# EAGLE design FT232 (EAGLE 8.1.0)
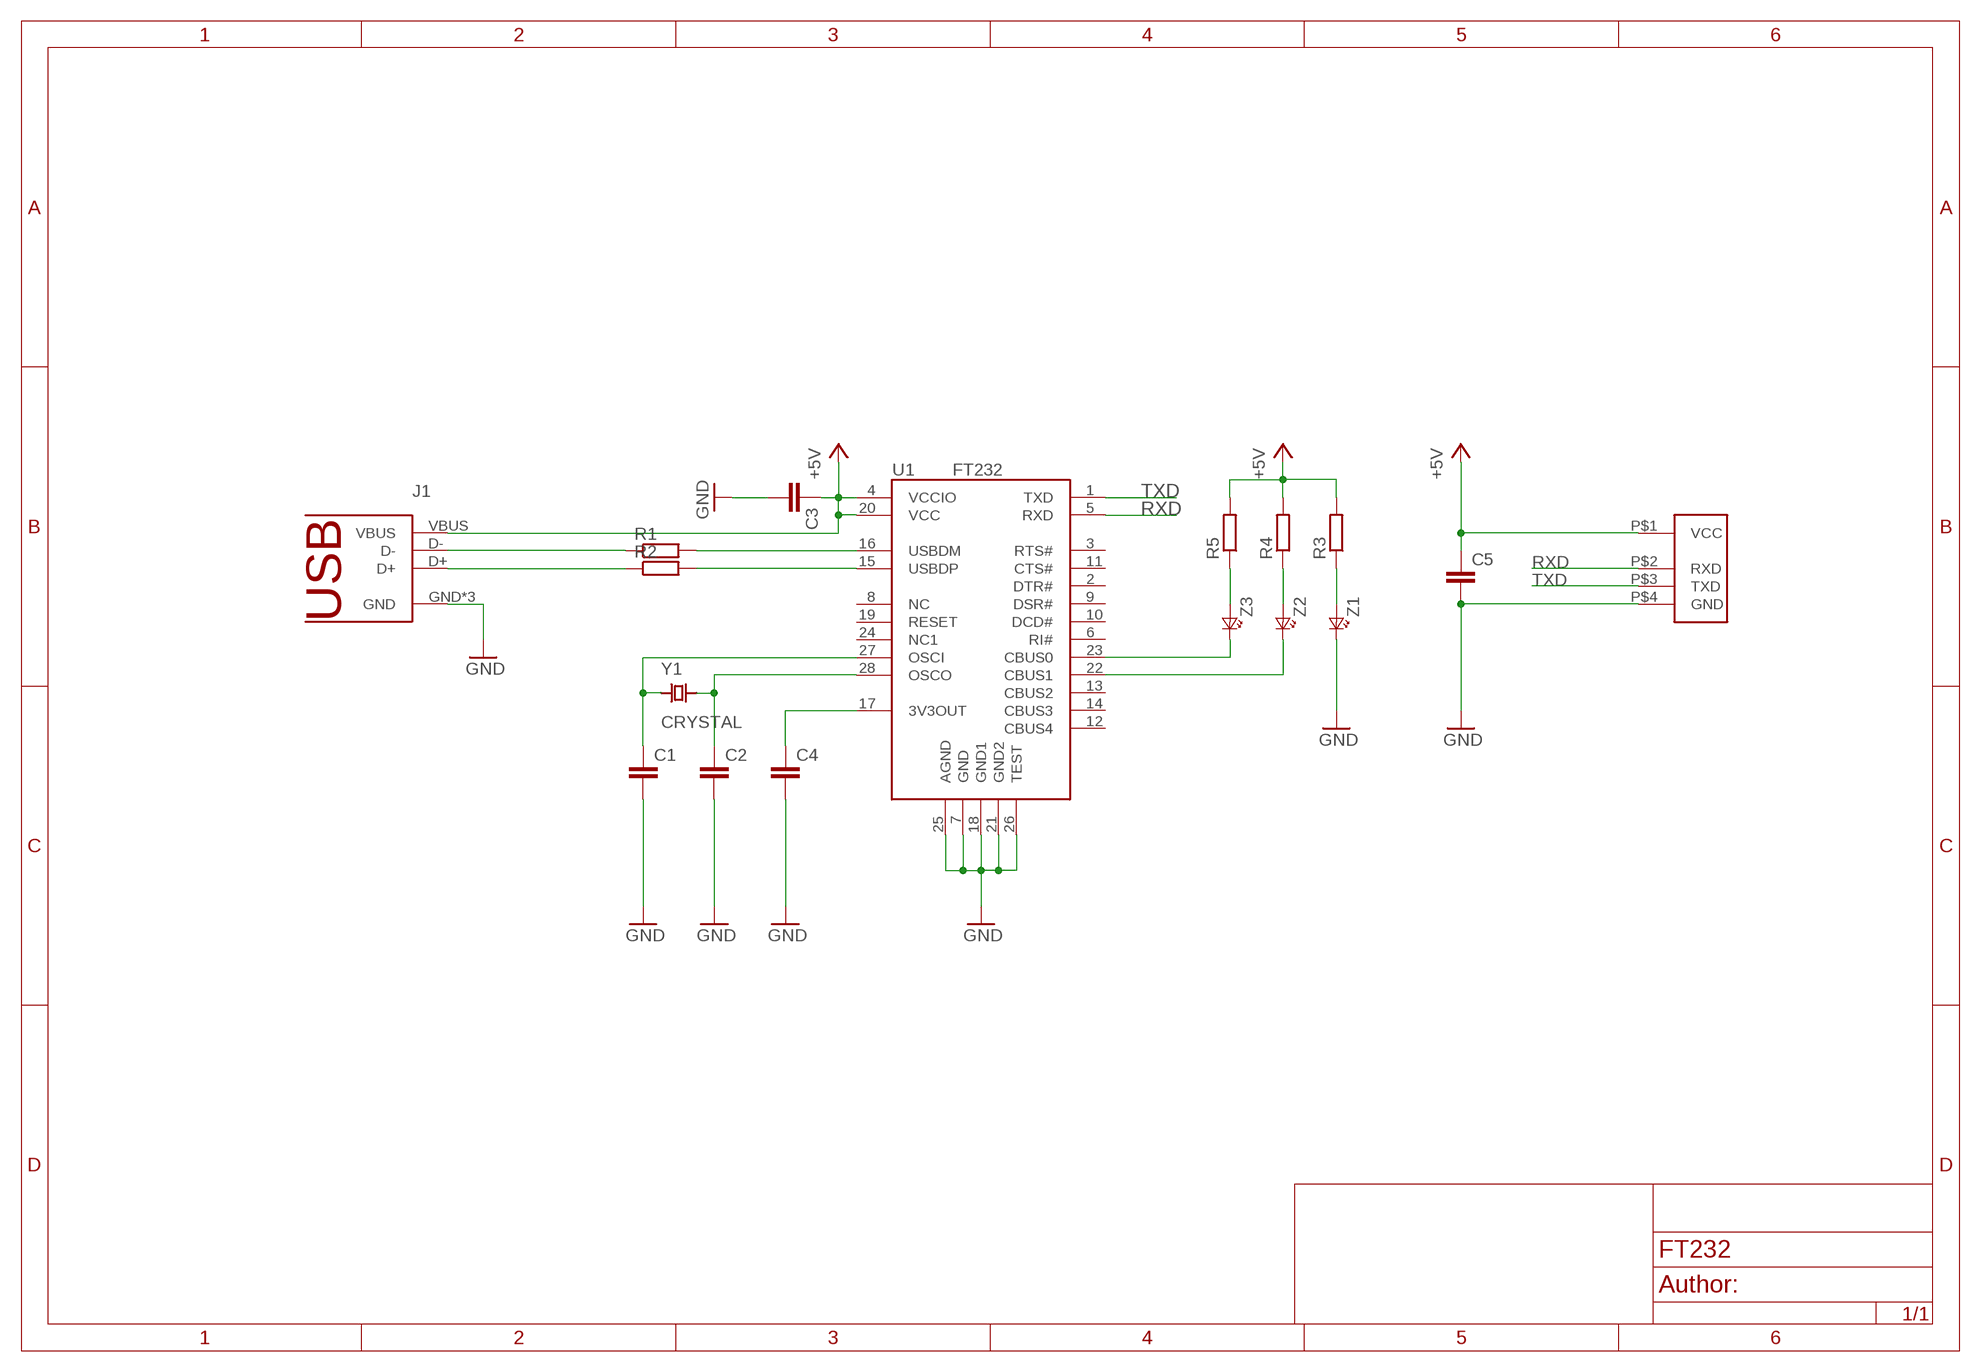
[diagram p0: schematic, sheet 1]

## Parts
C1  CAPACITOR0402  [C0402]
C2  CAPACITOR0402  [C0402]
C3  CAPACITOR0402  [C0402]
C4  CAPACITOR0402  [C0402]
C5  CAPACITOR0402  [C0402]
J1  USBA  [USB_A]
J2  CON  [CON4]
R1  RESISTOR0402  [R0402]
R2  RESISTOR0402  [R0402]
R3  RESISTOR0402  [R0402]
R4  RESISTOR0402  [R0402]
R5  RESISTOR0402  [R0402]
U1  FT232  [SSOP28]
Y1  CRYSTAL  [CRYSTAL5032]
Z1  LED  [LED0805]
Z2  LED  [LED0805]
Z3  LED  [LED0805]

## Nets
+5V: C3.1 C5.1 J1.VBUS J2.P$1(VCC) R3.2 R4.2 R5.2 U1.4(VCCIO) U1.20(VCC)
D_N: R1.2 U1.16(USBDM)
D_P: R2.2 U1.15(USBDP)
GND: C1.2 C2.2 C3.2 C4.2 C5.2 J1.GND J1.GND1(GND) J1.GND2(GND) J2.P$4(GND) U1.7(GND) U1.18(GND1) U1.21(GND2) U1.25(AGND) U1.26(TEST) Z1.K
N$3: J1.D- R1.1
N$4: J1.D+ R2.1
N$5: C2.1 U1.28(OSCO) Y1.2
N$6: C1.1 U1.27(OSCI) Y1.1
N$7: C4.1 U1.17(3V3OUT)
N$8: U1.23(CBUS0) Z3.K
N$9: U1.22(CBUS1) Z2.K
N$10: R5.1 Z3.A
N$11: R4.1 Z2.A
N$12: R3.1 Z1.A
RXD: J2.P$2(RXD) U1.5(RXD)
TXD: J2.P$3(TXD) U1.1(TXD)
Unconnected: U1.2(DTR#) U1.3(RTS#) U1.6(RI#) U1.8(NC) U1.9(DSR#) U1.10(DCD#) U1.11(CTS#) U1.12(CBUS4) U1.13(CBUS2) U1.14(CBUS3) U1.19(RESET) U1.24(NC1)

## Notes on the sheet
- Author:

## Library data of the parts
C1-C5 = FT232:CAPACITOR
J1 = FT232:USB
J2 = FT232:CON
R1-R5 = FT232:RESISTOR
U1 = FT232:FT232
Y1 = FT232:CRYSTAL
Z1-Z3 = FT232:LED

## Board
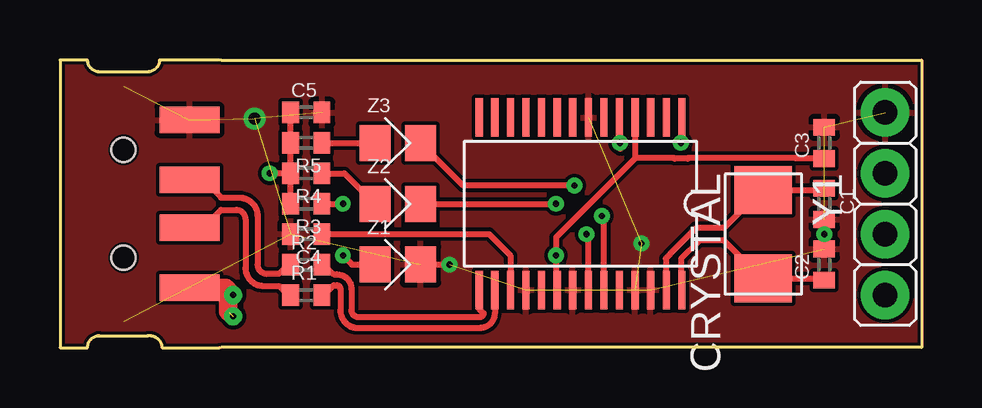
[diagram p1: board, top side]
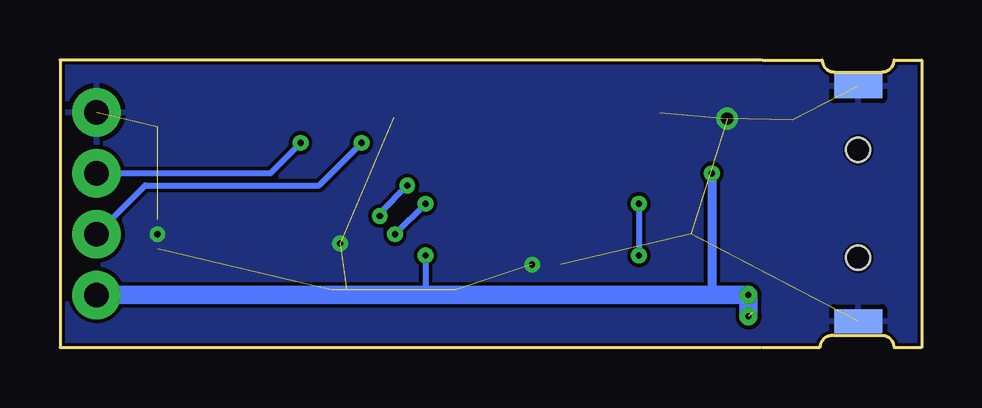
[diagram p2: board, bottom side, seen from below]

Size 35.92 x 12 mm. Coordinates in mm from the lower left corner, seen from the top.
Outline: 6.71,11.99 35.92,11.99 35.92,0.01 6.71,0.01
Copper layers (1*16): Top 0.035mm / dielectric 1.5mm / Bottom 0.035mm
Design rules "default *": minimum track width 10mil, minimum drill 24mil, track to track 6mil, track to pad 6mil, pad to pad 6mil, via to via 6mil, smd to smd 6mil, copper to edge 5mil, drill to drill 8mil, minimum pad ring 10mil, minimum via ring 8mil, stop-mask expansion 4mil, vias tented up to drill 0mil, thermal gap 8mil

### Footprints (pad centres in the part's own frame; a part is rotated, then mirrored left to right if it is on the bottom)
C0402 = smd 0.7 x 0.9: 1 -0.65,0; 2 0.65,0
USB_A = smd 1.1 x 2.5: D+ -1,2.75; D- 1,2.75; GND -3.5,2.75; VBUS 3.5,2.75 | smd 1 x 2 bottom: GND1 -4.9,0; GND2 4.9,0 | hole 1: -2.25,0; 2.25,0
CON4 = drill 1.016 pad 2.032: P$1 0,0; P$2 2.54,0; P$3 5.08,0; P$4 7.62,0
R0402 = smd 0.7 x 0.9: 1 -0.65,0; 2 0.65,0
SSOP28 = smd 1.6 x 0.3: 1 -3.6,4.225; 2 -3.6,3.575; 3 -3.6,2.925; 4 -3.6,2.275; 5 -3.6,1.625; 6 -3.6,0.975; 7 -3.6,0.325; 8 -3.6,-0.325; 9 -3.6,-0.975; 10 -3.6,-1.625; 11 -3.6,-2.275; 12 -3.6,-2.925; 13 -3.6,-3.575; 14 -3.6,-4.225; 15 3.6,-4.225; 16 3.6,-3.575; 17 3.6,-2.925; 18 3.6,-2.275; 19 3.6,-1.625; 20 3.6,-0.975; 21 3.6,-0.325; 22 3.6,0.325; 23 3.6,0.975; 24 3.6,1.625; 25 3.6,2.275; 26 3.6,2.925; 27 3.6,3.575; 28 3.6,4.225
CRYSTAL5032 = smd 2 x 2.4: 1 -1.85,0; 2 1.85,0
LED0805 = smd 1.3 x 1.5: A -0.95,0; K 0.95,0

### Placement (x,y rotation side)
C1  31.86,6 270 top
C2  31.86,3.46 90 top
C3  31.86,8.54 90 top
C4  10.27,4.73 180 top
C5  10.27,9.81 0 top
J1  2.65,6 270 top
J2  34.4,2.19 90 top
R1  10.27,2.19 0 top
R2  10.27,3.46 0 top
R3  10.27,6 180 top
R4  10.27,7.27 180 top
R5  10.27,8.54 180 top
U1  21.7,6 270 top
Y1  29.32,4.73 270 top
Z1  14.08,3.46 0 top
Z2  14.08,6 0 top
Z3  14.08,8.54 0 top

### Tracks (layer width: path | path; a pad name or v marks a point on that pad's centre or on a via)
+5V  (via drill 0.25 pad 0.25, 0.25 pad 0.76)  (1 unrouted)
  Top 0.254: C3.1 30.68,7.89 | 30.68,7.89 30.66,7.91 | U1.20 20.68,2.44 v20.68,3.84 20.68,4.6 23.99,7.91 | U1.4 23.98,7.93 23.99,7.91 | C5.1 R5.2 R4.2 | R4.2 v8.75,7.27 | R3.2 R4.2 | 30.68,7.89 30.66,7.91 | 30.66,7.91 26.2,7.91 26.16,7.88 25.62,7.88 25.59,7.91 23.99,7.91
  Top 0.762: 6.26,2.5 J1.VBUS 6.91,2.5 7.02,2.39 7.02,1.5 7.06,1.47
  Bottom 0.254: v20.68,3.84 20.68,2.32 20.56,2.19
  Bottom 0.381: v8.75,7.27 8.75,2.44 8.49,2.19
  Bottom 0.762: J2.P$1 20.56,2.19 8.49,2.19 v7.22,2.19 v7.22,1.3
D_N
  Top 0.254: R1.2 11.01,2.19 11.41,2.6 11.54,2.6 arc-90 11.69,2.44 11.69,1.55 arc90 12.43,0.82 17.51,0.82 arc90 18.12,1.43 U1.16
D_P
  Top 0.254: R2.2 11.01,3.46 11.41,3.05 11.54,3.05 arc-90 12.15,2.44 12.15,1.55 arc90 12.43,1.28 17.51,1.28 arc90 17.66,1.43 17.48,1.61 U1.15
GND  (via drill 0.25 pad 0.25, 0.51 pad 0.51)  (15 unrouted)
  Top 0.254: C2.2 v31.86,4.73 C1.2 | Z1.K v16.24,3.46
  other vias: 24.24,4.35 8.11,9.56
  pour Bottom: -0.02,11.97 35.8,12.1 35.92,-0.1 -0.02,-0.1
  pour Top: -0.02,11.97 35.8,12.1 35.8,11.97 35.92,-0.1 -0.02,-0.1
N$3
  Top 0.254: J1.D- 5.97,5 6.71,5.75 7.35,5.75 arc-90 7.73,5.37 7.73,3.33 arc90 8.49,2.57 9.13,2.57 9.51,2.19 R1.1
N$4
  Top 0.254: J1.D+ 5.97,7 6.71,6.25 7.48,6.25 arc-90 8.24,5.49 8.24,3.46 arc90 8.62,3.08 9.13,3.08 9.51,3.46 R2.1
N$5
  Top 0.254: U1.28 25.89,2.43 25.89,3.71 26.65,4.48 27.67,4.48 29.27,2.88 Y1.2 31.79,2.88 C2.1
N$6
  Top 0.254: U1.27 25.26,2.42 25.26,3.71 25.43,3.89 25.43,3.9 26.51,4.98 27.67,4.98 29.27,6.58 Y1.1 31.79,6.58 C1.1
N$7
  Top 0.254: C4.1 17.89,4.73 18.78,3.84 U1.17
N$8  (via drill 0.25 pad 0.25)
  Top 0.254: U1.23 22.68,5.41 v22.59,5.49 | v21.45,6.76 16.81,6.76 Z3.K
  Bottom 0.254: v22.59,5.49 22.59,5.62 v21.45,6.76
N$9  (via drill 0.25 pad 0.25)
  Top 0.254: U1.22 22.03,4.66 v21.95,4.73 | Z2.K v20.68,6
  Bottom 0.254: v21.95,4.73 v20.68,6
N$10
  Top 0.254: R5.1 Z3.A
N$11
  Top 0.254: R4.1 11.86,7.27 Z2.A
N$12  (via drill 0.25 pad 0.25)
  Top 0.254: R3.1 v11.79,6 | v11.79,3.84 12.18,3.46 Z1.A
  Bottom 0.254: v11.79,6 v11.79,3.84
RXD  (via drill 0.25 pad 0.25)
  Top 0.254: U1.5 23.35,9.57 v23.35,8.54 23.35,8.29
  Bottom 0.254: J2.P$2 32.37,6.76 25.13,6.76 v23.35,8.54
TXD  (via drill 0.25 pad 0.25)
  Top 0.254: U1.1 25.89,9.57 v25.89,8.54 25.89,8.41
  Bottom 0.254: v25.89,8.54 27.16,7.27 J2.P$3